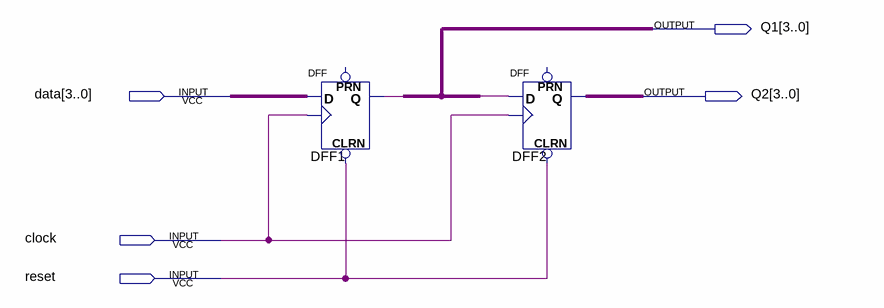
[diagram p0: schematic sheet]
// Quartus schematic dfftest.bdf as structural Verilog: 2 symbols, 5 pins
module dfftest (
  input  [3:0] data,
  input  clock,
  input  reset,
  output [3:0] Q1,
  output [3:0] Q2
);

  wire DFF1_q, undriven;

  DFF DFF1[3:0] (.CLRN(reset), .CLK(clock), .D(data), .Q(DFF1_q));  // open: PRN
  DFF DFF2[3:0] (.CLRN(reset), .CLK(clock), .D(undriven), .Q(Q2));  // open: PRN
endmodule
